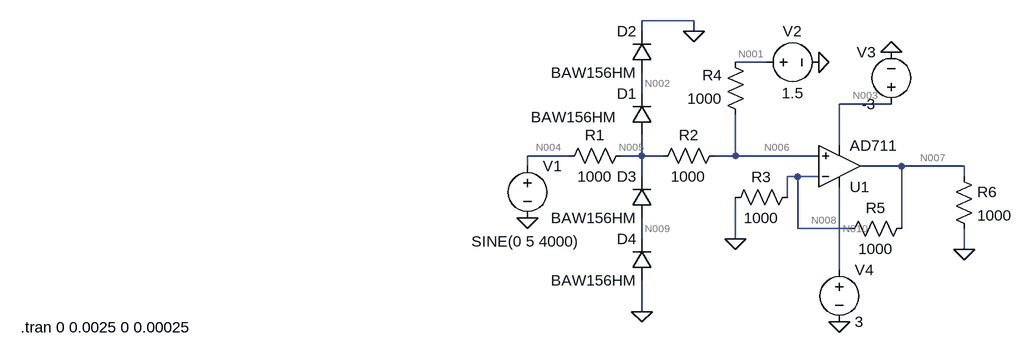
[diagram p0: schematic Protection Circuit Sim.asc]
Protection Circuit Sim.asc, the LTspice schematic file:
Version 4
SHEET 1 880 680
WIRE 272 -80 192 -80
WIRE 192 -64 192 -80
WIRE 272 -64 272 -80
WIRE 384 -16 336 -16
WIRE 192 32 192 0
WIRE 576 48 496 48
WIRE 496 112 496 48
WIRE 80 128 16 128
WIRE 192 128 192 96
WIRE 192 128 160 128
WIRE 224 128 192 128
WIRE 336 128 336 64
WIRE 336 128 304 128
WIRE 464 128 336 128
WIRE 16 144 16 128
WIRE 592 144 528 144
WIRE 688 144 592 144
WIRE 192 160 192 128
WIRE 432 160 416 160
WIRE 464 160 432 160
WIRE 688 160 688 144
WIRE 416 192 416 160
WIRE 432 240 432 160
WIRE 512 240 432 240
WIRE 592 240 592 144
WIRE 192 256 192 224
WIRE 336 256 336 192
WIRE 688 272 688 240
WIRE 496 304 496 176
WIRE 192 368 192 320
FLAG 16 224 0
FLAG 272 -64 0
FLAG 192 368 0
FLAG 336 256 0
FLAG 688 272 0
FLAG 464 -16 0
FLAG 496 384 0
FLAG 576 -32 0
SYMBOL voltage 16 128 R0
WINDOW 3 -86 132 Left 2
WINDOW 123 0 0 Left 0
WINDOW 39 0 0 Left 0
SYMATTR InstName V1
SYMATTR Value SINE(0 5 4000)
SYMBOL res 176 112 R90
WINDOW 0 0 56 VBottom 2
WINDOW 3 32 56 VTop 2
SYMATTR InstName R1
SYMATTR Value 1000
SYMBOL res 320 112 R90
WINDOW 0 0 56 VBottom 2
WINDOW 3 32 56 VTop 2
SYMATTR InstName R2
SYMATTR Value 1000
SYMBOL res 432 176 R90
WINDOW 0 0 56 VBottom 2
WINDOW 3 32 56 VTop 2
SYMATTR InstName R3
SYMATTR Value 1000
SYMBOL res 352 80 R180
WINDOW 0 36 76 Left 2
WINDOW 3 36 40 Left 2
SYMATTR InstName R4
SYMATTR Value 1000
SYMBOL res 496 256 R270
WINDOW 0 32 56 VTop 2
WINDOW 3 0 56 VBottom 2
SYMATTR InstName R5
SYMATTR Value 1000
SYMBOL res 672 144 R0
SYMATTR InstName R6
SYMATTR Value 1000
SYMBOL OpAmps\\AD711 496 208 M180
SYMATTR InstName U1
SYMBOL voltage 368 -16 R270
WINDOW 0 32 56 VTop 2
WINDOW 3 -32 56 VBottom 2
WINDOW 123 0 0 Left 0
WINDOW 39 0 0 Left 0
SYMATTR InstName V2
SYMATTR Value 1.5
SYMBOL diode 208 96 R180
WINDOW 0 24 64 Left 2
WINDOW 3 55 28 Left 2
SYMATTR InstName D1
SYMATTR Value BAW156HM
SYMBOL diode 208 0 R180
WINDOW 0 24 64 Left 2
WINDOW 3 24 0 Left 2
SYMATTR InstName D2
SYMATTR Value BAW156HM
SYMBOL diode 208 224 R180
WINDOW 0 24 64 Left 2
WINDOW 3 24 0 Left 2
SYMATTR InstName D3
SYMATTR Value BAW156HM
SYMBOL diode 208 320 R180
WINDOW 0 24 64 Left 2
WINDOW 3 24 0 Left 2
SYMATTR InstName D4
SYMATTR Value BAW156HM
SYMBOL voltage 576 64 R180
WINDOW 0 24 96 Left 2
WINDOW 3 24 16 Left 2
WINDOW 123 0 0 Left 0
WINDOW 39 0 0 Left 0
SYMATTR InstName V3
SYMATTR Value -3
SYMBOL voltage 496 288 R0
WINDOW 123 0 0 Left 0
WINDOW 39 0 0 Left 0
SYMATTR InstName V4
SYMATTR Value 3
TEXT -764 392 Left 2 !.tran 0 0.0025 0 0.00025

The netlist it stands for:
* Protection Circuit Sim.asc
V1 N004 0 SINE(0 5 4000)
R1 N005 N004 1000
R2 N006 N005 1000
R3 N008 0 1000
R4 N006 N001 1000
R5 N008 N007 1000
R6 N007 0 1000
XU1 N006 N008 N010 N003 N007 AD712  ; AD711, pins In+ In- V+ V- OUT
V2 N001 0 1.5
D1 N005 N002 BAW156HM
D2 N002 0 BAW156HM
D3 N009 N005 BAW156HM
D4 0 N009 BAW156HM
V3 N003 0 -3
V4 N010 0 3
.model D D
.lib standard.dio
.tran 0 0.0025 0 0.00025
.lib ADI1.lib
.backanno
.end

* Results of the author's LTspice run, read from the files saved beside the schematic
* Operating Point, zero values left out:
*   V(n005) = 500 mV
*   V(n006) = 1 V
*   V(n008) = 727.3 mV
*   V(n001) = 1.5 V
*   V(n007) = 1.455 V
*   V(n010) = 3 V
*   V(n003) = -3 V
*   V(n002) = 250 mV
*   V(n009) = 250 mV
*   I(D4) = -6.617 pA
*   I(D3) = -6.617 pA
*   I(D2) = 1.715 nA
*   I(D1) = 1.715 nA
*   I(R6) = 1.455 mA
*   I(R5) = -727.3 µA
*   I(R4) = -500 µA
*   I(R3) = 727.3 µA
*   I(R2) = 500 µA
*   I(R1) = 500 µA
*   I(V4) = -3.822 mA
*   I(V3) = 1.674 mA
*   I(V2) = -500 µA
*   I(V1) = 500 µA
*   Ix(u1:1) = 27.67 pA
*   Ix(u1:2) = 26.94 pA
*   Ix(u1:3) = 3.822 mA
*   Ix(u1:4) = -1.674 mA
*   Ix(u1:5) = -2.182 mA
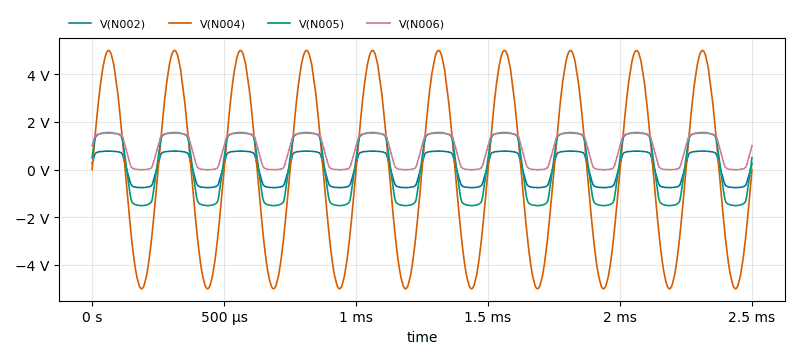
[diagram p1: Transient Analysis of Protection Circuit Sim.asc, plotted from the saved traces]
* Transient Analysis, 1 run:
*   V(N002): min -755.2 mV, max 775.8 mV, average 80.16 mV, rms 665.7 mV, last 249.9 mV
*   V(N004): min -5 V, max 5 V, average -3.763 mV, rms 3.53 V, last 0 V
*   V(N005): min -1.51 V, max 1.552 V, average 160.3 mV, rms 1.331 V, last 499.7 mV
*   V(N006): min -5.235 mV, max 1.526 V, average 830.2 mV, rms 1.061 V, last 999.8 mV